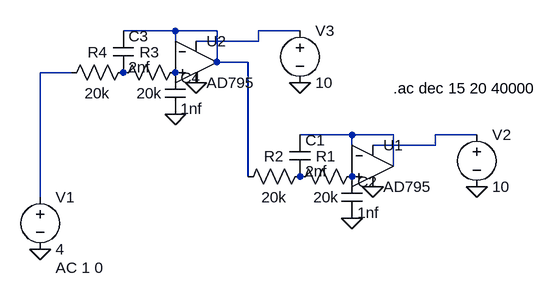
[diagram p0: schematic butterworthfilters.asc]
butterworthfilters.asc, the LTspice schematic file:
Version 4
SHEET 1 880 680
WIRE -112 -32 -192 -32
WIRE -48 -32 -112 -32
WIRE 80 -32 16 -32
WIRE 16 -16 16 -32
WIRE 16 -16 -80 -16
WIRE -112 0 -112 -32
WIRE -48 16 -48 -32
WIRE 0 16 -48 16
WIRE -272 32 -320 32
WIRE 160 128 80 128
WIRE 224 128 160 128
WIRE 352 128 288 128
WIRE 288 144 288 128
WIRE 288 144 192 144
WIRE 160 160 160 128
WIRE 224 176 224 128
WIRE 0 192 0 16
WIRE -320 224 -320 32
FLAG -320 304 0
FLAG 160 256 0
FLAG 352 208 0
FLAG 192 208 0
FLAG -112 96 0
FLAG 80 48 0
FLAG -80 48 0
SYMBOL res 176 176 R90
WINDOW 0 0 56 VBottom 2
WINDOW 3 32 56 VTop 2
SYMATTR InstName R1
SYMATTR Value 20k
SYMBOL res 96 176 R90
WINDOW 0 0 56 VBottom 2
WINDOW 3 32 56 VTop 2
SYMATTR InstName R2
SYMATTR Value 20k
SYMBOL voltage -320 208 R0
WINDOW 123 24 124 Left 2
WINDOW 39 0 0 Left 0
SYMATTR InstName V1
SYMATTR Value 4
SYMATTR Value2 AC 1 0
SYMBOL cap 64 128 R0
SYMATTR InstName C1
SYMATTR Value 2nf
SYMBOL cap 144 192 R0
SYMATTR InstName C2
SYMATTR Value 1nf
SYMBOL Opamps\\AD795 192 112 R0
SYMATTR InstName U1
SYMBOL voltage 352 112 R0
WINDOW 123 0 0 Left 0
WINDOW 39 0 0 Left 0
SYMATTR InstName V2
SYMATTR Value 10
SYMBOL res -96 16 R90
WINDOW 0 0 56 VBottom 2
WINDOW 3 32 56 VTop 2
SYMATTR InstName R3
SYMATTR Value 20k
SYMBOL res -176 16 R90
WINDOW 0 0 56 VBottom 2
WINDOW 3 32 56 VTop 2
SYMATTR InstName R4
SYMATTR Value 20k
SYMBOL cap -208 -32 R0
SYMATTR InstName C3
SYMATTR Value 2nf
SYMBOL cap -128 32 R0
SYMATTR InstName C4
SYMATTR Value 1nf
SYMBOL Opamps\\AD795 -80 -48 R0
SYMATTR InstName U2
SYMBOL voltage 80 -48 R0
WINDOW 123 0 0 Left 0
WINDOW 39 0 0 Left 0
SYMATTR InstName V3
SYMATTR Value 10
TEXT 224 56 Left 2 !.ac dec 15 20 40000

The netlist it stands for:
* butterworthfilters.asc
R1 P001 P002 20k
R2 P002 N001 20k
V1 N003 0 4 AC 1 0
C1 N004 P002 2nf
C2 P001 0 1nf
XU1 P001 N004 N005 0 N004 AD795  ; pins In+ In- V+ V- OUT
V2 N005 0 10
R3 P003 P004 20k
R4 P004 N003 20k
C3 N001 P004 2nf
C4 P003 0 1nf
XU2 P003 N001 N002 0 N001 AD795  ; pins In+ In- V+ V- OUT
V3 N002 0 10
.ac dec 15 20 40000
.lib ADI1.lib
.backanno
.end